# EAGLE design badge_0.1 (EAGLE 7.1.0)
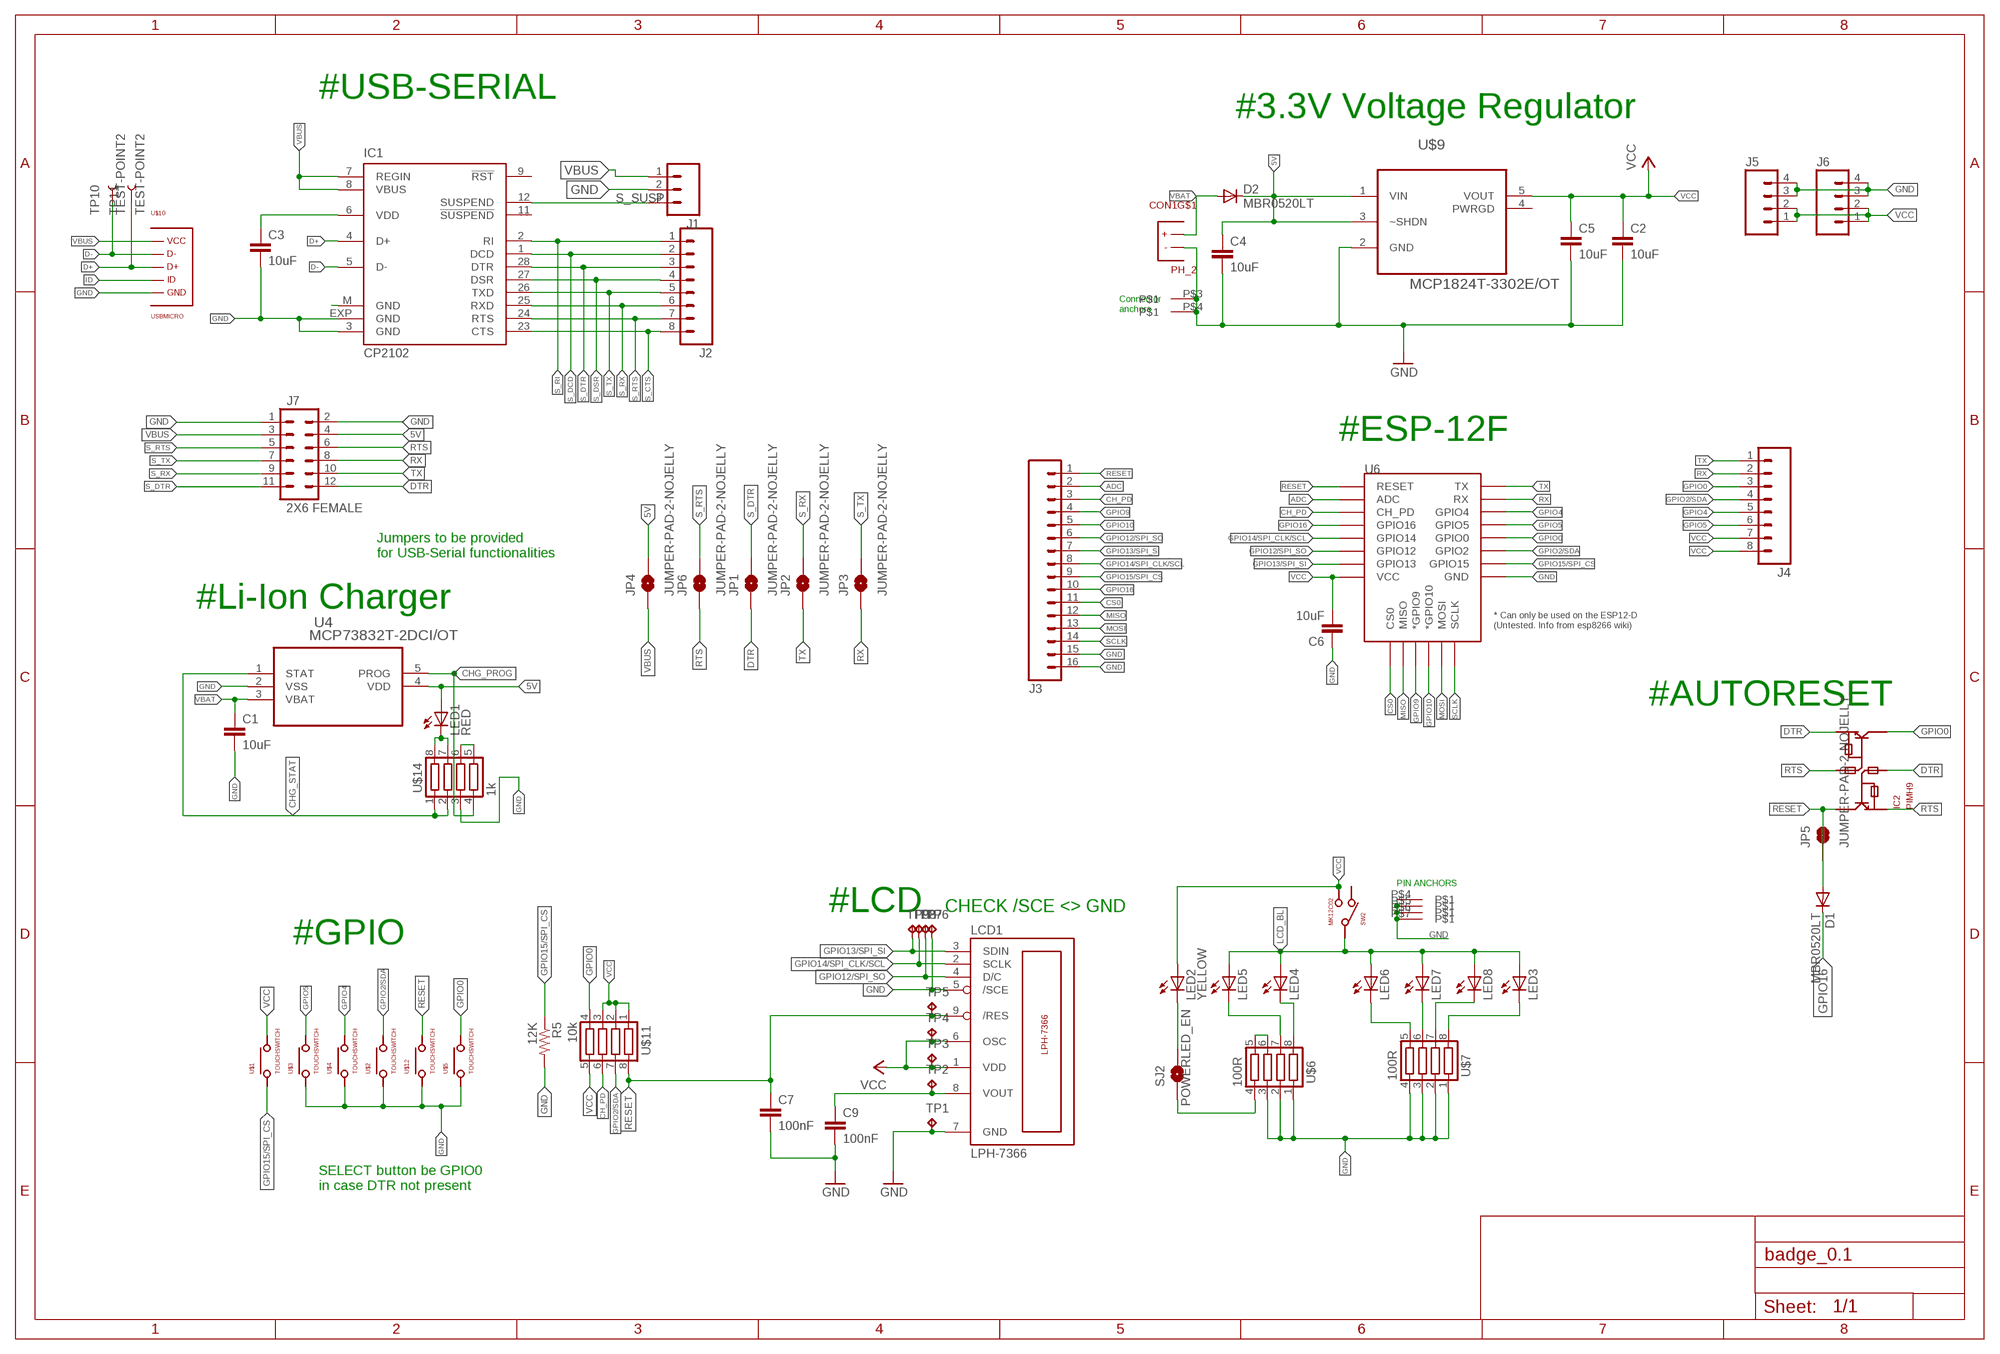
[diagram p0: schematic, sheet 1]

## Parts
C1  10uF  1UF-25V-10%(0805)"  [0805-CAP]
C2  10uF  1UF-25V-10%(0805)"  [0805-CAP]
C3  10uF  1UF-25V-10%(0805)"  [0805-CAP]
C4  10uF  1UF-25V-10%(0805)"  [0805-CAP]
C5  10uF  1UF-25V-10%(0805)"  [0805-CAP]
C6  10uF  1UF-25V-10%(0805)"  [0805-CAP]
C7  100nF  1UF-25V-10%(0805)"  [0805-CAP]
C9  100nF  1UF-25V-10%(0805)"  [0805-CAP]
CON1  PH_2  [PH_2]
D1  MBR0520LT  [SOD123]
D2  MBR0520LT  [SOD123]
IC1  CP2102  [MLP28]
IC2  PIMH9  [SOT457]
J1  M03PTH  [1X03]
J2  M08SILK_FEMALE_PTH  [1X08]
J3  M16PTH  [1X16]
J4  M08  [1X08_ROUND]
J5  M04PTH  [1X04]
J6  M04PTH  [1X04]
J7  2X6 FEMALE  M06X2PTH_FEMALE  [2X6]
JP1  JUMPER-PAD-2-NOJELLY  [JELLYPAD-JUMPER-2-NO_NO_SILK]
JP2  JUMPER-PAD-2-NOJELLY  [JELLYPAD-JUMPER-2-NO_NO_SILK]
JP3  JUMPER-PAD-2-NOJELLY  [JELLYPAD-JUMPER-2-NO_NO_SILK]
JP4  JUMPER-PAD-2-NOJELLY  [JELLYPAD-JUMPER-2-NO_NO_SILK]
JP5  JUMPER-PAD-2-NOJELLY  [JELLYPAD-JUMPER-2-NO_NO_SILK]
JP6  JUMPER-PAD-2-NOJELLY  [JELLYPAD-JUMPER-2-NO_NO_SILK]
LCD1  LPH-7366  [LPH-7366]
LED1  RED  LEDSML0805  [SML0805]
LED2  YELLOW  LEDSML0805  [SML0805]
LED3  LEDSML0805  [SML0805]
LED4  LEDSML0805  [SML0805]
LED5  LEDSML0805  [SML0805]
LED6  LEDSML0805  [SML0805]
LED7  LEDSML0805  [SML0805]
LED8  LEDSML0805  [SML0805]
R5  12K  RESISTOR0805-RES  [0805]
SJ2  POWERLED_EN  SOLDERJUMPERTRACE  [SJ_2S-TRACE]
SW2  MK12C02  [MK12C02]
TP1  TPB1,27  [B1,27]
TP2  TPB1,27  [B1,27]
TP3  TPB1,27  [B1,27]
TP4  TPB1,27  [B1,27]
TP5  TPB1,27  [B1,27]
TP6  TPB1,27  [B1,27]
TP7  TPB1,27  [B1,27]
TP8  TPB1,27  [B1,27]
TP9  TPB1,27  [B1,27]
TP10  TEST-POINT2  [PAD.02X.02]
TP11  TEST-POINT2  [PAD.02X.02]
U4  MCP73832T-2DCI/OT  [SOT95P300X145-5N]
U6  ESP12ESMD  [ESP12E-SMD]
U$1  TOUCHSWITCH  [EVQQWN03W]
U$2  TOUCHSWITCH  [EVQQWN03W]
U$3  TOUCHSWITCH  [EVQQWN03W]
U$4  TOUCHSWITCH  [EVQQWN03W]
U$5  TOUCHSWITCH  [EVQQWN03W]
U$6  100R  RES_ARR  [YC164]
U$7  100R  RES_ARR  [YC164]
U$9  MCP1824T-3302E/OT  [SOT95P270X145-5N]
U$10  USBMICRO  [USBMICRO]
U$11  10k  RES_ARR  [YC164]
U$12  TOUCHSWITCH  [EVQQWN03W]
U$14  1k  RES_ARR  [YC164]

## Nets
5V: C4.1 D2.C J7.4 JP4.2 LED1.A U4.4(VDD) U$9.1(VIN) U$9.3(~SHDN)
ADC: J3.2 U6.ADC
CH_PD: J3.3 U6.CH_PD U$11.6
CHG_PROG: U4.5(PROG) U$14.4
CHG_STAT: U4.1(STAT) U$14.1 U$14.2
CS0: J3.11 U6.CS0
D+: IC1.4(D+) TP11.P$1 U$10.P$D+
D-: IC1.5(D-) TP10.P$1 U$10.P$D-
DTR: IC2.P$2 IC2.P$4 J7.12 JP1.1
GND: C1.2 C2.2 C3.2 C4.2 C5.2 C6.1 C7.2 C9.2 CON1.P$1 CON1.P$3 CON1.P$4 IC1.3(GND) IC1.EXP(GND) J1.2 J3.15 J3.16 J5.3 J5.4 J6.3 J6.4 J7.1 J7.2 LCD1.5(/SCE) LCD1.7(GND) R5.2 SW2.P$4 SW2.P$5 SW2.P$6 SW2.P$7 TP1.TP TP6.TP U4.2(VSS) U6.GND U$2.P$1 U$2.P$4 U$3.P$1 U$3.P$4 U$4.P$1 U$4.P$4 U$5.P$1 U$5.P$4 U$6.1 U$6.2 U$6.3 U$7.1 U$7.2 U$7.3 U$7.4 U$9.2(GND) U$10.P$GND U$12.P$1 U$12.P$4 U$14.3
GPIO0: IC2.P$3 J4.3 U6.GPIO0 U$5.P$2 U$5.P$3 U$11.4
GPIO2/SDA: J4.4 U6.GPIO2 U$2.P$2 U$2.P$3 U$11.7
GPIO4: J4.5 U6.GPIO4 U$4.P$2 U$4.P$3
GPIO5: J4.6 U6.GPIO5 U$3.P$2 U$3.P$3
GPIO9: J3.4 U6.GPIO9(*GPIO9)
GPIO10: J3.5 U6.GPIO10(*GPIO10)
GPIO12/SPI_SO: J3.6 LCD1.4(D/C) TP7.TP U6.GPIO12
GPIO13/SPI_SI: J3.7 LCD1.3(SDIN) TP9.TP U6.GPIO13
GPIO14/SPI_CLK/SCL: J3.8 LCD1.2(SCLK) TP8.TP U6.GPIO14
GPIO15/SPI_CS: J3.9 R5.1 U6.GPIO15 U$1.P$1 U$1.P$4
GPIO16: D1.C J3.10 U6.GPIO16
ID: U$10.P$ID
LCD_BL: LED3.A LED4.A LED5.A LED6.A LED7.A LED8.A SW2.P$2
MISO: J3.12 U6.MISO
MOSI: J3.13 U6.MOSI
N$1: LED1.C U$14.7 U$14.8
N$2: U$14.5 U$14.6
N$5: IC1.M(GND)
N$7: LED7.C U$7.6
N$8: LED8.C U$7.7
N$9: C9.1 LCD1.8(VOUT) TP2.TP
N$11: U$6.5 U$6.6
N$12: LED4.C U$6.8
N$13: LED5.C U$6.7
N$14: LED3.C U$7.8
N$15: SJ2.1 U$6.4
N$16: LED2.C SJ2.2
N$20: C3.1 IC1.6(VDD)
N$22: LED6.C U$7.5
RESET: C7.1 D1.A IC2.P$6 J3.1 JP5.1 JP5.2 LCD1.9(/RES) TP5.TP U6.RESET U$11.8 U$12.P$2 U$12.P$3
RTS: IC2.P$1 IC2.P$5 J7.6 JP6.1
RX: J4.2 J7.8 JP3.1 U6.RXD0(RX)
S_CTS: IC1.23(CTS) J2.8
S_DCD: IC1.1(DCD) J2.2
S_DSR: IC1.27(DSR) J2.4
S_DTR: IC1.28(DTR) J2.3 J7.11 JP1.2
S_RI: IC1.2(RI) J2.1
S_RTS: IC1.24(RTS) J2.7 J7.5 JP6.2
S_RX: IC1.25(RXD) J2.6 J7.9 JP2.2
S_SUSP: IC1.12(SUSPEND) J1.3
S_TX: IC1.26(TXD) J2.5 J7.7 JP3.2
SCLK: J3.14 U6.SCLK
TX: J4.1 J7.10 JP2.1 U6.TXD0(TX)
VBAT: C1.1 CON1.P$2 D2.A U4.3(VBAT)
VBUS: IC1.7(REGIN) IC1.8(VBUS) J1.1 J7.3 JP4.1 U$10.P$VCC
VCC: C2.1 C5.1 C6.2 J4.7 J4.8 J5.1 J5.2 J6.1 J6.2 LCD1.1(VDD) LCD1.6(OSC) LED2.A SW2.P$3 TP3.TP TP4.TP U6.VCC U$1.P$2 U$1.P$3 U$9.5(VOUT) U$11.1 U$11.2 U$11.3 U$11.5
Unconnected: IC1.9(!RST) IC1.11(!SUSPEND) SW2.P$1 U$9.4(PWRGD)

## Notes on the sheet
- #USB-SERIAL
- #3.3V Voltage Regulator
- Connector
  anchors
- #ESP-12F
- Jumpers to be provided
  for USB-Serial functionalities
- #Li-Ion Charger
- #AUTORESET
- PIN ANCHORS
- #LCD | CHECK /SCE <> GND
- #GPIO
- SELECT button be GPIO0
  in case DTR not present

## Library data of the parts
C1-C7 C9 = SparkFun-Capacitors:1UF-25V-10%(0805): CAP-08064
CON1 = badge:PH_2
D1 D2 = diode:MBR0520LT: SCHOTTKY BARRIER RECTIFIER Source: http://onsemi.com .. MBR0520LT1-D.pdf
IC1 = silabs:CP210*: Single-Chip USB to UART Bridge Source: www.silabs.com .. CP2101.pdf / cp2102.pdf; MF: FARNELL; MPN: CP2102-GM; OC_FARNELL: 9282130; OC_NEWARK: 30K5635
IC2 = badge:PIMH9
J1 = SparkFun-Connectors:M03: Header 3 Standard 3-pin 0.1" header. Use with straight break away headers (SKU : PRT-00116), right angle break away headers (PRT-00553), swiss pins (PRT-00743), machine pins (PRT-00117), and female headers (PRT-00115). Molex polarized connector foot print use with SKU : PRT-08232 with associated crimp pins and housings.
J2 = SparkFun-Connectors:M08: Header 8 Standard 8-pin 0.1" header. Use with straight break away headers (SKU : PRT-00116), right angle break away headers (PRT-00553), swiss pins (PRT-00743), machine pins (PRT-00117), and female headers (PRT-00115).; PROD_ID: CONN-08438
J3 = SparkFun-Connectors:M16: 1x16 .1" header
J4 = SparkFun-Connectors:M08: Header 8 Standard 8-pin 0.1" header. Use with straight break away headers (SKU : PRT-00116), right angle break away headers (PRT-00553), swiss pins (PRT-00743), machine pins (PRT-00117), and female headers (PRT-00115).; PROD_ID: CONN-08437
J5 J6 = SparkFun-Connectors:M04: Header 4 Standard 4-pin 0.1" header. Use with straight break away headers (SKU : PRT-00116), right angle break away headers (PRT-00553), swiss pins (PRT-00743), machine pins (PRT-00117), and female headers (PRT-00115). Molex polarized connector foot print use with SKU : PRT-08231 with associated crimp pins and housings. 1MM SMD Version SKU: PRT-10208; PROD_ID: CONN-09696
J7 = SparkFun-Connectors:M06X2; PROD_ID: CONN-12423
JP1-JP6 = SparkFun-Passives:JUMPER-PAD-2-NO
LCD1 = gm2:LPH-7366
LED1-LED8 = led:LED: LED OSRAM: - CHIPLED LG R971, LG N971, LY N971, LG Q971, LY Q971, LO R971, LY R971 LH N974, LH R974 LS Q976, LO Q976, LY Q976 LO Q996 - Hyper CHIPLED LW Q18S LB Q993, LB Q99A, LB R99A - SideLED LS A670, LO A670, LY A670, LG A670, LP A670 LB A673, LV A673, LT A673, LW A673 LH A674 LY A675 LS A676, LA A676, LO A676, LY A676, LW A676 LS A679, LY A679, LG A679 - Hyper Micro SIDELED® LS Y876, LA Y876, LO Y876, LY Y876 LT Y87S - SmartLED LW L88C, LW L88S LB L89C, LB L89S, LG L890 LS L89K, LO L89K, LY L89K LS L896, LA L896, LO L896, LY L896 - TOPLED LS T670, LO T670, LY T670, LG T670, LP T670 LSG T670, LSP T670, LSY T670, LOP T670, LYG T670 LG T671, LOG T671, LSG T671 LB T673, LV T673, LT T673, LW T673 LH T674 LS T676, LA T676, LO T676, LY T676, LB T676, LH T676, LSB T676, LW T676 LB T67C, LV T67C, LT T67C, LS T67K, LO T67K, LY T67K, LW E67C LS E67B, LA E67B, LO E67B, LY E67B, LB E67C, LV E67C, LT E67C LW T67C LS T679, LY T679, LG T679 LS T770, LO T770, LY T770, LG T770, LP T770 LB T773, LV T773, LT T773, LW T773 LH T774 LS E675, LA E675, LY E675, LS T675 LS T776, LA T776, LO T776, LY T776, LB T776 LHGB T686 LT T68C, LB T68C - Hyper Mini TOPLED® LB M676 - Mini TOPLED Santana® LG M470 LS M47K, LO M47K, LY M47K Source: http://www.osram.convergy.de LUXEON: - LUMILED® LXK2-PW12-R00, LXK2-PW12-S00, LXK2-PW14-U00, LXK2-PW14-V00 LXK2-PM12-R00, LXK2-PM12-S00, LXK2-PM14-U00 LXK2-PE12-Q00, LXK2-PE12-R00, LXK2-PE12-S00, LXK2-PE14-T00, LXK2-PE14-U00 LXK2-PB12-K00, LXK2-PB12-L00, LXK2-PB12-M00, LXK2-PB14-N00, LXK2-PB14-P00, LXK2-PB14-Q00 LXK2-PR12-L00, LXK2-PR12-M00, LXK2-PR14-Q00, LXK2-PR14-R00 LXK2-PD12-Q00, LXK2-PD12-R00, LXK2-PD12-S00 LXK2-PH12-R00, LXK2-PH12-S00 LXK2-PL12-P00, LXK2-PL12-Q00, LXK2-PL12-R00 Source: www.luxeon.com KINGBRIGHT: KA-3528ASYC Source: www.kingbright.com
R5 = SparkFun-Passives:RESISTOR: Resistor Basic schematic elements and footprints for 0603, 1206, and PTH resistors.
SJ2 = SparkFun-Retired:SOLDERJUMPER: Solder Jumper Standard SMD solder jumper. Used to automate production. Two varients : Normally Open and Normally Closed are the same, but have different paste layers. NC will have a large amount of paste and should jumper during reflow.
SW2 = badge:MK12C02
TP1-TP9 = testpad:TP: Test pad
TP10 TP11 = SparkFun-Passives:TEST-POINT: Bare copper test points for troubleshooting or ICT
U4 = Microchip_By_element14_Batch_1:MCP73832T-2DCI/OT: IC, BATT CHARGER, Li-Ion Li-Polymer, 500 mA; MPN: MCP73832T-2DCI/OT; OC_FARNELL: 1834892; OC_NEWARK: 84R5198; PACKAGE: SOT23-5; SUPPLIER: Microchip
U6 = esp8266modules:ESP12E: ESP12E Module
U$1-U$5 U$12 = badge:TOUCHSWITCH
U$6 U$7 U$11 U$14 = Simplex-rlc:RES_ARR: resistor chip array yageo YC164 series (8pin/4R)
U$9 = Microchip_By_element14_Batch_1:MCP1824T-3302E/OT: 300 mA, Low Voltage, Low Quiescent Current LDO Regulator; MPN: MCP1824T-3302E/OT; OC_FARNELL: 1578387; OC_NEWARK: 40M0704; PACKAGE: SOT23-5; SUPPLIER: Microchip
U$10 = badge:USBMICRO

## Board
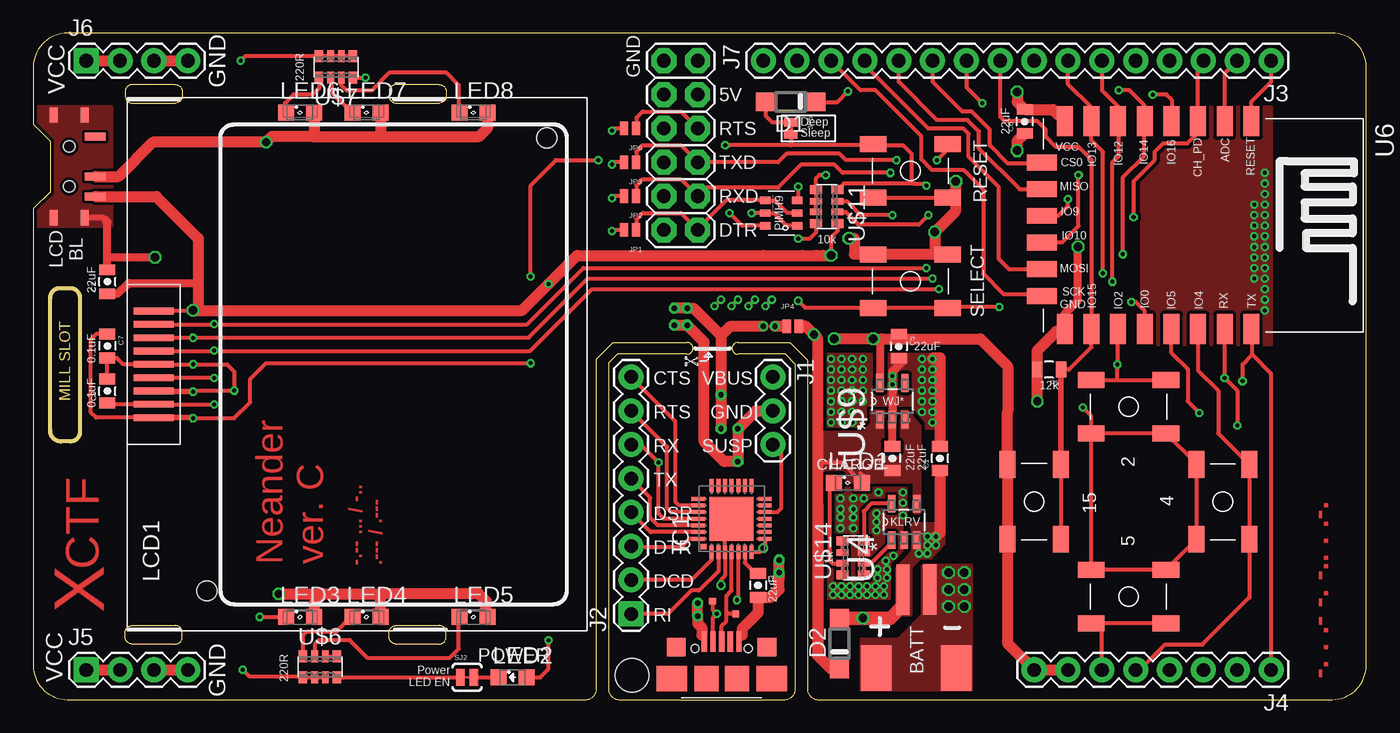
[diagram p1: board, top side]
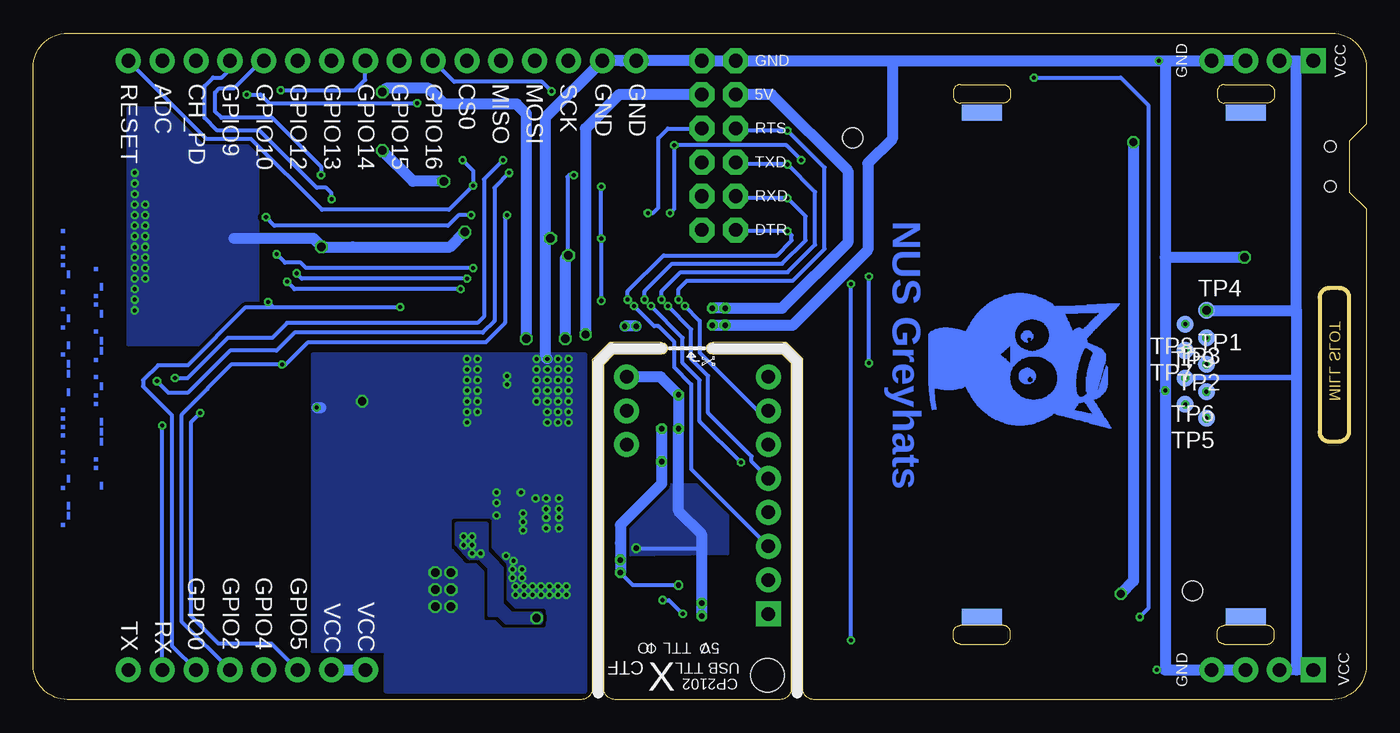
[diagram p2: board, bottom side, seen from below]

Size 100 x 50 mm. Coordinates in mm from the lower left corner, seen from the top.
Outline: 58.88,0 97.46,0 arc90 100,2.54 100,47.46 arc90 97.46,50 2.54,50 arc90 0,47.46 0,43.18 1.27,41.91 1.27,38.1 0,36.83 0,2.54 arc90 2.54,0 41.45,0 arc90 42.27,0.81 42.27,25.56 43.5,26.79 49.05,26.79 arc-180 49.05,25.92 43.81,25.92 43.14,25.24 43.14,0.81 arc90 43.95,0 56.38,0 arc90 57.19,0.81 57.19,25.16 56.44,25.92 52.86,25.92 arc-180 52.86,26.79 56.75,26.79 58.06,25.48 58.06,0.81 arc90 58.88,0
Outline: 1.27,30.16 arc-90 1.98,30.88 2.78,30.88 arc-90 3.49,30.16 3.49,20.08 arc-90 2.78,19.37 2.06,19.37 arc-90 1.27,20.16 1.27,30.16
Copper layers (1*16): Top 0.035mm / dielectric 1.5mm / Bottom 0.035mm
Design rules "dirt_cheap_dirty_boards.v1 *": minimum track width 5mil, minimum drill 12mil, track to track 5mil, track to pad 5mil, pad to pad 5mil, via to via 5mil, smd to smd 0mil, copper to edge 10mil, drill to drill 10mil, minimum pad ring 10mil, minimum via ring 6mil, stop-mask expansion 2mil, vias tented up to drill 25mil, thermal gap 10mil
Holes 2.54 mm at 44.93,1.83

### Footprints (pad centres in the part's own frame; a part is rotated, then mirrored left to right if it is on the bottom)
0805-CAP = smd 0.8 x 1.2: 1 -0.9,0; 2 0.9,0
PH_2 = smd 1 x 3.8: P$1 -1,0; P$2 1,0 | smd 2.3 x 3.4: P$3 -3,5.9; P$4 3,5.9
SOD123 = smd 1.4 x 1.4: A 1.9,0; C -1.9,0
MLP28 = smd 1 x 0.3: 1 -2.5,1.5; 2 -2.5,1; 3 -2.5,0.5; 4 -2.5,0; 5 -2.5,-0.5; 6 -2.5,-1; 7 -2.5,-1.5; 15 2.5,-1.5; 16 2.5,-1; 17 2.5,-0.5; 18 2.5,0; 19 2.5,0.5; 20 2.5,1; 21 2.5,1.5 | smd 0.3 x 1: 8 -1.5,-2.5; 9 -1,-2.5; 10 -0.5,-2.5; 11 0,-2.5; 12 0.5,-2.5; 13 1,-2.5; 14 1.5,-2.5; 22 1.5,2.5; 23 1,2.5; 24 0.5,2.5; 25 0,2.5; 26 -0.5,2.5; 27 -1,2.5; 28 -1.5,2.5 | smd 3.3 x 3.3: EXP 0,0 | smd 0.435 x 0.435: M -2.103,2.103
SOT457 = smd 0.8 x 0.55: P$1 1.2,-0.95; P$2 1.2,0; P$3 1.2,0.95; P$4 -1.2,0.95; P$5 -1.2,0; P$6 -1.2,-0.95
1X03 = drill 1.016 pad 1.88: 1 0,0; 2 2.54,0; 3 5.08,0
1X08 = drill 1.016 pad 1.88 square: 1 0,0 | drill 1.016 pad 1.88: 2 2.54,0; 3 5.08,0; 4 7.62,0; 5 10.16,0; 6 12.7,0; 7 15.24,0; 8 17.78,0
1X16 = drill 1.016 pad 1.88: 1 0,0; 2 2.54,0; 3 5.08,0; 4 7.62,0; 5 10.16,0; 6 12.7,0; 7 15.24,0; 8 17.78,0; 9 20.32,0; 10 22.86,0; 11 25.4,0; 12 27.94,0; 13 30.48,0; 14 33.02,0; 15 35.56,0; 16 38.1,0
1X08_ROUND = drill 1.016 pad 1.88: 1 0,0; 2 2.54,0; 3 5.08,0; 4 7.62,0; 5 10.16,0; 6 12.7,0; 7 15.24,0; 8 17.78,0
1X04 = drill 1.016 pad 1.88 square: 1 0,0 | drill 1.016 pad 1.88: 2 2.54,0; 3 5.08,0; 4 7.62,0
2X6 = drill 1.016 pad 1.88 octagon: 1 0,0; 2 0,2.54; 3 2.54,0; 4 2.54,2.54; 5 5.08,0; 6 5.08,2.54; 7 7.62,0; 8 7.62,2.54; 9 10.16,0; 10 10.16,2.54; 11 12.7,0; 12 12.7,2.54
JELLYPAD-JUMPER-2-NO_NO_SILK = smd 0.635 x 1.016: 1 -0.45,0; 2 0.45,0
LPH-7366 = smd 0.5 x 3: 1 4,17; 2 3,17; 3 2,17; 4 1,17; 5 0,17; 6 -1,17; 7 -2,17; 8 -3,17; 9 -4,17 | smd 1.2 x 3 bottom: F1 -18.9,17; F2 18.9,17; F3 18.9,-2.8; F4 -18.95,-2.8 | hole 1.5: -17,13; 17,-12.5
SML0805 = smd 1.2 x 1.2: A 1.05,0; C -1.05,0
0805 = smd 0.8 x 1.2: 1 -0.9,0; 2 0.9,0
SJ_2S-TRACE = smd 0.635 x 1.27: 1 -0.508,0; 2 0.508,0
MK12C02 = smd 0.6 x 1.6: P$1 -2.25,1.95; P$2 0.75,1.95; P$3 2.25,1.95 | smd 1.15 x 0.6: P$4 -3.85,1.15; P$5 -3.85,-1.15; P$6 3.85,1.15; P$7 3.85,-1.15 | hole 0.85: -1.5,0; 1.5,0
B1,27 = smd 1.27 x 1.27: TP 0,0
PAD.02X.02 = smd 0.508 x 0.508: P$1 0,0
SOT95P300X145-5N = smd 1.321 x 0.559: 1 -1.372,0.94; 2 -1.372,0; 3 -1.372,-0.94; 4 1.372,-0.94; 5 1.372,0.94
ESP12E-SMD = smd 2.25 x 1.2: ADC -7.9,3.8; CH_PD -7.9,1.8; GND 7.7,-8.2; GPIO0 7.7,-2.2; GPIO2 7.7,-4.2; GPIO4 7.7,1.8; GPIO5 7.7,-0.2; GPIO12 -7.9,-4.2; GPIO13 -7.9,-6.2; GPIO14 -7.9,-2.2; GPIO15 7.7,-6.2; GPIO16 -7.9,-0.2; RESET -7.9,5.8; RXD0 7.7,3.8; TXD0 7.7,5.8; VCC -7.9,-8.2 | smd 1.2 x 2.25: CS0 -4.8,-9.9; GPIO9 -0.8,-9.9; GPIO10 1.2,-9.9; MISO -2.8,-9.9; MOSI 3.2,-9.9; SCLK 5.2,-9.9
EVQQWN03W = smd 1.2 x 2: P$1 -2,2.8; P$2 2,2.8; P$3 2,-2.8; P$4 -2,-2.8
YC164 = smd 0.65 x 0.9: 1 -1.275,-0.8; 4 1.275,-0.8; 5 1.275,0.8; 8 -1.275,0.8 | smd 0.5 x 0.9: 2 -0.4,-0.8; 3 0.4,-0.8; 6 0.4,0.8; 7 -0.4,0.8
SOT95P270X145-5N = smd 1.321 x 0.559: 1 -1.372,0.94; 2 -1.372,0; 3 -1.372,-0.94; 4 1.372,-0.94; 5 1.372,0.94
USBMICRO = smd 1.4 x 1.4: P$6 -3.4,2.35; P$7 3.4,2.35 | smd 1.8 x 1.9: P$8 -1.15,0; P$9 1.15,0 | smd 2.3 x 1.9: P$10 -3.75,0; P$11 3.75,0 | smd 0.4 x 1.55: P$D+ 0,2.775; P$D- -0.65,2.775; P$GND 1.3,2.775; P$ID 0.65,2.775; P$VCC -1.3,2.775 | hole 0.6: -2,2.25; 2,2.25

### Placement (x,y rotation side)
C1  68.02,18.1 90 top
C2  5.56,31.35 90 top
C3  54.37,8.57 270 top
C4  64.45,18.1 90 top
C5  64.93,26.51 270 top
C6  74.38,43.39 90 top
C7  5.56,26.54 270 top
C9  5.56,23.15 90 top
CON1  66.25,8.26 180 top
D1  56.83,44.85 180 top
D2  60.48,4.21 90 top
IC1  52.39,13.57 90 top
IC2  56.12,36.51 0 top
J1  55.48,24.21 270 top
J2  44.85,6.43 90 top
J3  92.87,47.94 180 top
J4  92.87,2.22 180 top
J5  3.97,2.22 0 top
J6  3.97,47.94 0 top
J7  47.31,47.94 270 top
JP1  44.77,35.24 180 top
JP2  44.77,37.78 180 top
JP3  44.77,40.32 180 top
JP4  56.99,28.02 0 top
JP5  56.83,42.86 270 top
JP6  44.77,42.86 180 top
LCD1  26.04,25.16 90 top
LED1  61.12,16.27 0 top
LED2  35.96,1.67 0 top
LED3  20,6.19 0 top
LED4  25,6.19 0 top
LED5  33.02,6.19 0 top
LED6  20,44.05 0 top
LED7  25,44.05 0 top
LED8  33.02,44.05 0 top
R5  76.2,24.77 180 top
SJ2  32.54,1.67 0 top
SW2  2.7,40.01 270 top
TP1  11.99,25.16 0 bottom
TP2  13.57,22.15 0 bottom
TP3  13.57,24.13 0 bottom
TP4  11.99,29.21 0 bottom
TP5  11.99,21.11 180 bottom
TP6  11.99,23.1 180 bottom
TP7  13.57,26.19 180 bottom
TP8  13.57,28.18 180 bottom
TP9  11.99,27.15 180 bottom
TP10  50.96,7.38 0 top
TP11  52.7,6.43 0 top
U4  65.33,13.34 90 top
U6  85.59,35.5 270 top
U$1  75.1,14.85 180 top
U$2  82.17,21.98 90 top
U$3  82.17,7.73 270 top
U$4  89.24,14.84 0 top
U$5  65.8,31.4 270 top
U$6  21.51,2.46 0 top
U$7  22.7,47.47 180 top
U$9  64.45,22.38 90 top
U$10  51.65,1.59 0 top
U$11  59.53,36.99 270 top
U$12  65.8,39.69 90 top
U$14  61.52,10.64 90 top

### Tracks (layer width: path | path; a pad name or v marks a point on that pad's centre or on a via)
5V  (via drill 0.61)
  Top 0.305: U$9.3 65.39,20.97 | 57.94,28.02 JP4.2 | 62.07,16.99 62.23,16.83 62.23,16.51 62.17,16.45 LED1.A 60.66,17.78 59.05,17.78 58.9,17.62 58.9,14.61
  Top 0.406: 65.39,20.97 65.63,20.97
  Top 0.813: 58.9,3.25 58.9,14.61 | 58.9,3.25 59.85,2.3 59.85,2.31 D2.C | 57.63,28.02 57.94,28.02 v58.58,27.38 58.82,27.15 58.82,3.33 58.9,3.25
  Bottom 0.813: J7.4 56.04,45.4 58.58,42.86 v58.58,27.38
  pour Top (isolate 0.254, no thermals): 66.12,19.76 66.12,14.05 66.52,14.05 66.52,19.76
  pour Top (isolate 0.254, no thermals): 62.87,21.59 62.87,20.64 62.23,20 58.58,20 58.58,16.35 66.52,16.35 66.52,20.48 65.56,21.59
ADC
  Top 0.305: 89.39,42.55 89.39,47 J3.2
  Top 0.406: 89.39,42.55 U6.ADC
CH_PD  (via drill 0.3)
  Top 0.305: U6.CH_PD 87.39,42.55 87.31,42.48 86.59,41.75 84.77,41.75 84.14,41.12 84.14,40.48 82.55,38.89 v82.55,36.2 | U6.CH_PD 87.39,47.54 J3.3 | v67.15,36.35 66.43,35.64 61.92,35.64 60.96,36.59 U$11.6 | U6.CH_PD
  Top 0.406: 87.31,42.48 87.39,42.48 U6.CH_PD
  Bottom 0.305: v67.15,36.35 68.1,36.35 68.9,35.56 81.92,35.56 v82.55,36.2
CHG_PROG
  Top 0.305: U4.5 62.89,14.71 62.31,14.13 62.31,11.92 U$14.4
CHG_STAT
  Top 0.305: 64.37,12.22 64.39,12.21 U4.1 64.39,11.76 62.86,10.24 U$14.2 U$14.1
CS0
  Top 0.305: J3.11 67.47,46.35 69.69,44.13 70.41,44.13 71.75,42.78 71.75,41.59 73.09,40.25 75.69,40.25 U6.CS0
D+
  Top 0.305: U$10.P$D+ 51.65,5.53 51.99,5.87 51.99,6.43 | 51.99,6.43 51.99,7.78 52.39,8.18 IC1.4 | TP11.P$1 51.99,6.43
D-  (via drill 0.3)
  Top 0.305: U$10.P$D- 51,6.15 v51.28,6.43 50.96,6.75 TP10.P$1 | v52.78,7.46 52.89,7.56 IC1.5
  Bottom 0.305: v51.28,6.43 52.31,7.46 v52.78,7.46
DTR
  Top 0.305: IC2.P$2 56.59,36.51 55.64,37.46 IC2.P$4 51.99,37.47 49.85,35.32 J7.12 48.58,36.51 45.72,36.51 45.24,36.04 45.24,35.27 JP1.1
GND  (via drill 0.3, 0.41, 0.41 pad 0.81, 0.61, 0.64)
  Top 0.305: U$7.1 U$7.2 U$7.3 U$7.4 15.88,48.27 v15.56,47.94 | U$6.3 U$6.2 U$6.1 20.15,1.75 16.19,1.75 v15.72,2.22 | 69.11,33.5 67.63,33.5 | 61.44,34.77 61.59,34.61 | U$4.P$1 U$4.P$4 | U$2.P$1 U$2.P$4 87.24,17.7 | U$3.P$1 U$3.P$4 U$2.P$1 | J6.3 8.97,47.94 | TP6.TP 9.1,23.1 LCD1.7 9.02,23.18 v15.08,23.18 15.08,24.61 14.53,25.16 TP1.TP LCD1.5 6.75,25.16 6.27,25.64 C7.2 C9.2 | v51.59,8.57 51.59,8.97 51.89,9.26 IC1.3 51.89,12.91 52.05,13.07 52.05,13.23 IC1.EXP | U$10.P$GND 52.95,4.61 53.18,4.84 | U$3.P$1 87.23,11.99 | U$2.P$1 79.37,21.28 v78.74,21.91 | U$12.P$1 U$12.P$4 69.22,37.07 69.22,36.67
  Top 0.406: SW2.P$6 5.24,36.16 5.4,36
  Top 0.546: 15.06,23.16 v15.08,23.18
  Top 0.61: 65.17,25.32 64.45,24.61 v64.45,24.29 v64.45,23.65 U$9.2 C4.2 | U$4.P$1 87.24,17.7 | U$4.P$4 87.24,12 | U6.GND 77.39,28.97 78.38,29.96 v78.38,33.97 | C6.1 74.38,42.47 | U$3.P$1 | C2.2 5.56,33.18 | 5.56,33.18 5.56,35.84 5.4,36 | v9.13,33.18 5.56,33.18
  Top 0.813: C1.2 68.02,25.64 67.55,25.64 v67.47,25.56 | 77.39,27.55 U6.GND | U6.GND 77.39,27.54 | 67.63,33.5 v67.63,35.08 69.22,36.67 v69.22,38.89 69.2,38.88 | J5.3 J5.4 | J6.3 J6.4 | v55.96,9.53 v55.96,10.48 | v48.1,28.1 v49.05,28.1 50.32,26.83 50.32,19.37 51.83,17.86 v52.86,17.86 v52.86,20.32 54.21,21.67 J1.2 | v61.2,34.61 61.59,34.61 61.59,33.4 U$5.P$4 U$5.P$1 | v73.82,41.2 73.82,41.93 C6.1 | 77.37,27.78 U6.GND | v55.96,9.53 55.96,9.05 | 53.18,4.84 53.18,5.32 54.37,6.51 C3.2 55.38,7.67 55.96,8.26 v55.96,9.53 | 77.39,27.45 77.39,27.55 | 77.39,27.55 77.31,27.62 76.76,27.62 75.3,26.17 R5.2 75.3,22.41 v75.33,22.38
  Bottom 0.305: 55.56,47.62 55.88,47.94 | 55.56,47.78 55.4,47.94 | 15.08,2.22 v15.72,2.22 | 55.88,11.83 55.96,11.75 | 55.88,9.45 v55.96,9.53 55.01,8.57 v51.59,8.57
  Bottom 0.406: 76.2,34.13 76.04,33.97
  Bottom 0.813: 61.59,34.45 61.59,43.66 J3.15 55.88,47.94 55.4,47.94 J3.16 J7.2 J7.1 35.24,47.94 | v67.63,35.08 68.74,33.97 76.04,33.97 v78.38,33.97 78.38,34.01 78.98,34.61 84.93,34.61 | J6.3 J6.4 15.08,47.94 | 35.24,47.94 v15.56,47.94 15.08,47.94 | 15.08,47.94 15.08,33.18 | 15.08,33.18 v15.08,23.18 15.08,2.22 J5.4 J5.3 | v52.86,20.32 v52.86,17.86 52.86,16.19 55.96,13.1 55.96,11.75 v55.96,10.48 v55.96,9.53 | v49.05,28.1 v48.1,28.1 43.02,28.1 37.39,33.73 37.39,40.24 35.56,42.07 35.56,47.62 35.24,47.94 | v61.2,34.61 61.44,34.61 61.59,34.45 | v9.13,33.18 15.08,33.18 | 61.59,34.45 61.59,25.72 v61.44,25.56 | v69.22,38.89 71.52,38.89 v73.82,41.2 | v78.74,21.91 78.42,21.91
  other vias: 60.64,25.56 62.23,25.56 60.64,24.77 61.44,24.77 62.23,24.77 62.23,23.97 61.44,23.97 60.64,23.97 60.64,23.18 61.44,23.18 62.23,23.18 62.23,22.38 61.44,22.38 60.64,22.38 60.64,21.59 61.44,21.59 61.44,20.8 60.64,20.8 66.67,25.56 66.67,24.77 66.67,23.97 66.67,23.18 66.67,22.38 66.67,21.59 65.25,14.76 68.66,9.53 65.25,15.56 63.26,13.97 63.26,13.34 63.26,12.7 60.64,7.86 61.91,7.86 62.55,7.86 63.18,7.86 61.28,7.86 59.85,25.56 59.85,24.77 59.85,23.97 59.85,23.18 59.85,22.38 59.85,21.59 59.85,20.8 67.47,20.8 67.47,21.59 67.47,22.38 67.47,23.18 67.47,23.97 67.47,24.77 68.66,6.99 92.39,39.53 92.39,38.73 92.39,37.94 91.6,37.15 92.39,37.15 91.6,36.35 92.39,36.35 91.6,35.56 92.39,35.56 91.6,34.77 92.39,34.77 91.6,33.97 92.39,33.97 91.6,33.18 92.39,33.18 91.6,32.38 92.39,32.38 91.6,31.59 92.39,31.59 92.39,30.8 92.39,30 92.39,29.21 11.99,23.1 11.99,25.16 68.66,8.26 69.85,6.99 69.85,8.26 69.85,9.53 63.18,8.49 62.55,8.49 61.91,8.49 61.28,8.49 60.64,8.49 63.82,7.86 63.82,8.49 60.01,7.86 60.01,8.49 63.34,9.13 64.06,9.13 64.06,9.76 63.34,9.76 63.98,10.4 64.53,10.79 65.25,13.81 60.56,12.86 61.52,12.86 61.52,13.65 60.56,13.65 61.52,14.29 60.56,14.29 61.52,15.08 60.56,15.08 62.31,15.08 63.42,15.56
  pour Top (isolate 0.254, rank 3, no thermals): 59.53,20.4 59.53,25.88 67.79,25.88 67.79,20.4
  pour Bottom (isolate 0.254, rank 3, no thermals): 58.58,25.88 79.06,25.88 79.06,3.65 73.58,3.65 73.58,0.64 58.58,0.64
  pour Top (isolate 0.203, rank 2, no thermals): 59.61,15.8 59.61,7.62 64.21,7.62 64.21,10.24 65.17,11.19 65.17,13.26 65.48,13.57 65.48,15.8
  pour Top (isolate 0.254): 92.87,44.45 92.87,26.65 83.19,26.65 83.19,44.45
  pour Bottom (isolate 0.254): 92.87,44.37 92.87,26.65 83.19,26.65 83.19,44.37
  pour Top (isolate 0.203, rank 2, no thermals): 0.24,44.45 0.24,35.56 5.87,35.56 5.87,44.45
  pour Top (isolate 0.254, rank 3, no thermals): 62.15,0.71 62.15,4.52 64.93,4.52 66.75,6.35 66.75,10.08 70.33,10.08 70.33,0.71
GPIO0  (via drill 0.3)
  Top 0.305: v82.39,29.84 82.71,29.84 83.39,29.17 U6.GPIO0 | v72.47,29.45 68.65,29.45 U$5.P$2 U$5.P$3 57.91,29.4 v57.39,29.92 | IC2.P$3 | IC2.P$3 | 58.49,35.71 U$11.4 58.74,35.08 58.26,34.61 v57.39,34.61 | IC2.P$3 57.39,37.53 v57.39,38.5
  Bottom 0.305: J4.3 89.61,4.05 89.61,21.35 91.76,23.5 91.76,23.97 90.65,25.08 88.42,25.08 84.06,29.45 81.99,29.45 | 82.31,29.84 v82.39,29.84 81.99,29.45 | 81.99,29.45 v72.47,29.45 | v57.39,38.5 v57.39,34.61 v57.39,29.92
GPIO2/SDA  (via drill 0.3 pad 0.3)
  Top 0.305: U$2.P$2 81.34,23.98 | 81.34,23.98 U$2.P$3 | 81.34,23.98 v81.34,25.13 81.34,27.75 U6.GPIO2 | v64.45,36.35 62.07,36.35 61.04,37.39 U$11.7
  Bottom 0.305: v64.45,36.35 64.61,36.2 64.61,28.26 66.04,26.83 79.38,26.83 81.07,25.13 v81.34,25.13 85.16,25.13 86.95,23.34 86.95,23.3 88.9,21.35 88.9,5.87 J4.4
GPIO4
  Top 0.305: U$4.P$2 U$4.P$3 91.24,7.66 87.71,4.13 84.93,4.13 83.03,2.22 J4.5 | 91.2,17.6 U$4.P$2 | U6.GPIO4 87.39,24.69 88.9,23.18 88.9,19.98 U$4.P$2
GPIO5  (via drill 0.3)
  Top 0.305: U$3.P$2 U$3.P$3 | U$3.P$3 | v87.47,21.51 86.6,22.38 86.6,24.8 85.39,26.01 U6.GPIO5 | J4.6 80.17,5.73 U$3.P$3
  Bottom 0.305: v87.47,21.51 88.19,20.8 88.19,6.27 86.12,4.21 82.15,4.21 J4.6
GPIO9  (via drill 0.3)
  Top 0.305: v77.63,37.54 77.63,37.04 76.89,36.3 U6.GPIO9 75.69,36.34
  Bottom 0.305: J3.4 85.25,47.31 85.88,46.67 86.52,46.67 87.15,46.04 87.15,43.66 86.2,42.7 83.03,42.7 78.74,38.42 78.03,38.42 77.63,38.02 v77.63,37.54
GPIO10  (via drill 0.3)
  Top 0.305: v78.42,39.37 78.42,35.54 77.18,34.3 U6.GPIO10
  Bottom 0.305: J3.5 82.87,47.94 84.93,45.88 86.04,45.88 86.36,45.56 86.36,44.13 85.88,43.66 82.07,43.66 78.42,40.01 v78.42,39.37
GPIO12/SPI_SO  (via drill 0.3, 0.3 pad 0.3)
  Top 0.305: v67.94,30.8 41.91,30.8 37.27,26.16 13.57,26.16 | J3.6 80.17,45.72 81.44,44.45 81.44,42.6 | 81.44,42.6 81.39,42.55 | 81.44,42.6 81.44,40.8 80.96,40.32 v80.96,31.35 | LCD1.4 13.57,26.16 | TP7.TP 13.57,26.16
  Top 0.406: 81.39,42.55 U6.GPIO12
  Bottom 0.305: v67.94,30.8 80.41,30.8 v80.96,31.35
  other vias: 13.57,26.19
GPIO13/SPI_SI  (via drill 0.3, 0.3 pad 0.3)
  Top 0.305: v67.47,31.59 41.59,31.59 37.16,27.16 TP9.TP | J3.7 77.63,46.2 79.39,44.44 U6.GPIO13 79.38,43.39 79.38,41.99 80.25,41.12 v80.25,31.99 | 79.38,42.54 79.39,42.55 | LCD1.3 TP9.TP | TP9.TP
  Top 0.406: 79.39,42.55 U6.GPIO13
  Bottom 0.305: v67.47,31.59 79.85,31.59 v80.25,31.99
  other vias: 11.99,27.15
GPIO14/SPI_CLK/SCL  (via drill 0.3, 0.3 pad 0.3)
  Top 0.305: v66.99,32.38 41.27,32.38 37.05,28.16 13.57,28.16 | 83.39,44.29 83.39,42.55 83.34,42.51 83.34,40.8 81.76,39.21 v81.76,33.42 | LCD1.2 13.57,28.16 | TP8.TP 13.57,28.16 | 83.39,44.41 83.39,44.57 82.23,45.72 v81.44,45.72
  Top 0.406: 83.34,42.51 83.39,42.51 U6.GPIO14 | 83.39,44.29 83.39,44.41
  Bottom 0.305: J3.8 75.09,46.51 75.88,45.72 v81.44,45.72 | v66.99,32.38 79.53,32.38 79.93,32.78 81.12,32.78 v81.76,33.42
  other vias: 13.57,28.18
GPIO15/SPI_CS
  Top 0.305: U$1.P$4 U$1.P$1 | 77.08,17.65 76.72,17.65 | J3.9 72.55,43.74 72.87,43.42 75.33,43.42 75.96,42.78 75.96,42.23 76.73,41.46 78.43,41.46 79.39,40.51 U6.GPIO15 79.39,26.44 77.71,24.77 R5.1
  Top 0.406: 77.08,17.65 U$1.P$4 R5.1
GPIO16  (via drill 0.3)
  Top 0.305: 85.39,42.55 85.41,42.57 85.41,45.01 85.01,45.4 v83.98,45.4 | J3.10 70.01,45.96 v71.2,44.77 | D1.C 60.33,44.85 v61.12,45.64
  Top 0.406: 85.39,42.55 U6.GPIO16
  Bottom 0.305: J3.10 68.42,46.35 61.83,46.35 v61.12,45.64 | v83.98,45.4 82.95,45.4 82.31,44.77 v71.2,44.77
LCD_BL  (via drill 0.6)
  Top 0.305: 26.05,7.88 26.11,7.94 | 26.05,42.27 26.04,42.26 | 21.05,42.35 20.95,42.26
  Top 0.813: 21.75,7.94 21.05,7.24 LED3.A | 21.75,7.94 26.11,7.94 33.42,7.94 33.97,7.38 33.97,6.29 LED5.A | LED4.A 26.05,7.88 | LED7.A 26.05,42.27 | LED6.A 21.05,42.35 | SW2.P$2 6.39,39.26 8.97,41.83 v17.46,41.83 17.89,42.26 20.95,42.26 26.04,42.26 33.44,42.26 34.07,42.88 LED8.A | v18.41,7.94 21.75,7.94
  Bottom 0.813: v17.46,41.83 17.46,8.89 v18.41,7.94
MISO
  Top 0.305: 75.69,38.25 U6.MISO 74,38.3 70.96,41.34 70.96,42.62 70.09,43.5 67.79,43.5 64.93,46.35 J3.12
MOSI
  Top 0.305: J3.13 62.39,47.62 67.15,42.86 69.77,42.86 70.17,42.47 70.17,40.74 72.41,38.49 72.41,33.09 73.2,32.3 U6.MOSI
N$1
  Top 0.305: U$14.7 59.94,10.23 59.77,10.4 59.77,15.97 LED1.C | U$14.7 | U$14.7 U$14.8
N$2
  Top 0.305: U$14.6 U$14.5
N$7
  Top 0.305: U$7.6 22.3,46.6 22.38,46.51 22.38,45.56 23.5,44.45 23.56,44.45 LED7.C
N$8
  Top 0.305: U$7.7 23.1,46.11 23.5,45.72 25.4,45.72 26.75,47.07 30.96,47.07 31.91,46.12 31.91,44.11 LED8.C
N$9  (via drill 0.3)
  Top 0.305: TP2.TP LCD1.8 5.65,22.16 C9.1
  other vias: 13.57,22.15
N$11
  Top 0.305: U$6.6 U$6.5
N$12
  Top 0.305: LED4.C 23.81,6.19 22.7,5.08 20.48,5.08 20.24,4.84 U$6.8
N$13
  Top 0.305: U$6.7 21.11,4.13 21.43,4.45 23.73,4.45 25.08,3.1 31.19,3.1 31.91,3.81 31.91,6.13 LED5.C
N$14  (via drill 0.3)
  Top 0.305: U$7.8 v24.92,46.67 | v16.99,6.19 LED3.C
  Bottom 0.305: v24.92,46.67 18.41,46.67 16.35,44.61 16.35,6.83 v16.99,6.19
N$15
  Top 0.305: U$6.4 SJ2.1
  Top 0.61: SJ2.1
N$16
  Top 0.305: 34.59,1.35 LED2.C SJ2.2
N$20
  Top 0.305: IC1.6 53.39,10.27 54.19,9.47 C3.1
N$22
  Top 0.305: 18.73,44.28 LED6.C 18.89,44.11 18.89,44.77 19.53,45.4 20.95,45.4 21.43,45.88 21.43,46.51 21.43,46.52 U$7.5
RESET  (via drill 0.3, 0.3 pad 0.3)
  Top 0.305: 91.39,42.55 91.39,44.87 92.87,46.35 J3.1 | 66.04,38.73 66.83,38.73 v66.99,38.58 | U$12.P$3 68.99,41.69 v67.79,40.48 | 66.04,38.73 65.88,38.89 65.88,40.96 65.25,41.59 63.02,41.59 | 66.04,38.73 60.8,38.73 U$11.8 | IC2.P$6 53.18,35.56 v52.23,36.51 | TP5.TP 15.08,21.11 16.27,22.3 16.27,24.05 17.46,25.24 v37.31,25.24 | v37.31,31.75 37.31,38.58 39.21,40.48 v42.39,40.48 | U$12.P$2 63,41.61 63.02,41.59 | 63.02,41.59 56.83,41.59 | 56.83,41.59 v51.91,41.59 | 56.83,41.59 JP5.2 JP5.1 56.81,43.34 55.4,43.34 54.93,43.81 D1.A | C7.1 4.73,27.43 4.29,26.99 4.29,21.59 4.72,21.16 LCD1.9
  Top 0.406: LCD1.9 11.94,21.16 TP5.TP | 91.39,42.55 U6.RESET
  Bottom 0.305: J3.1 87,42.07 83.66,42.07 78.34,36.75 68.82,36.75 v66.99,38.58 66.99,39.69 v67.79,40.48 | v37.31,25.24 v37.31,31.75 | v42.39,40.48 43.5,41.59 v51.91,41.59 51.91,36.83 v52.23,36.51
  other vias: 11.99,21.11
RTS  (via drill 0.3)
  Top 0.305: IC2.P$1 56.51,35.56 55.56,36.51 IC2.P$5 v53.9,36.51 | J7.6 48.58,44.13 45.72,44.13 45.24,43.66 45.24,42.89 JP6.1
  Bottom 0.305: v53.9,36.51 53.5,36.51 53.1,36.91 53.1,42.15 52.39,42.86 J7.6
RX  (via drill 0.3, 0.3 pad 0.3)
  Top 0.305: v64.77,40.48 60.96,40.48 60.48,40.96 56.52,40.96 55.88,40.32 J7.8 48.58,41.59 45.72,41.59 45.24,41.12 45.24,40.35 JP3.1 | U6.RXD0 89.38,27.79 v89.38,24.13 90.33,23.18 v90.33,20.56
  Bottom 0.305: v64.77,40.48 66.2,39.05 66.2,28.73 66.67,28.26 80.96,28.26 82.07,27.15 85.41,27.15 88.42,24.13 v89.38,24.13 | J4.2 v90.33,20.56
S_CTS
  Top 0.305: J2.8 48.18,20.88 48.18,14.84 48.45,14.57 IC1.23
S_DCD
  Top 0.305: IC1.1 50.89,10.49 49.37,8.97 J2.2
S_DSR
  Top 0.305: IC1.27 46.32,12.57 J2.4
S_DTR  (via drill 0.3)
  Top 0.305: v54.93,29.53 v55.4,30 | 47.25,35.19 J7.11 | IC1.28 49.22,12.07 48.58,11.43 44.93,11.43 J2.3 | JP1.2 43.5,35.24 v43.42,35.16
  Bottom 0.305: J2.3 50.64,17.3 50.64,23.65 51.91,24.92 51.91,26.83 53.1,28.02 53.42,28.02 v54.93,29.53 | v55.4,30 55.4,30.64 52.7,33.34 44.21,33.34 43.1,34.45 43.1,34.85 v43.42,35.16 47.23,35.16 J7.11
S_RI
  Top 0.305: J2.1 47.62,6.43 49.37,8.18 49.93,8.18 51.39,9.64 IC1.2
S_RTS  (via drill 0.3)
  Top 0.305: v51.12,29.53 v51.59,30 | J2.7 47.55,18.97 47.55,14.37 47.84,14.07 IC1.24 | 47.17,42.73 J7.5 | JP6.2 43.58,42.86 v43.42,42.7
  Bottom 0.305: v51.59,30 51.59,30.8 50.96,31.43 43.02,31.43 40.64,33.81 40.64,39.93 v43.42,42.7 47.15,42.7 J7.5 | J2.7 45.64,21.67 50.01,26.04 50.01,28.42 v51.12,29.53
S_RX  (via drill 0.3)
  Top 0.305: v53.66,29.53 v54.13,30 | J2.6 45.56,19.13 v46.91,17.78 46.91,13.97 47.31,13.57 IC1.25 | 47.17,37.65 J7.9 | JP2.2 43.58,37.78 v43.42,37.62
  Bottom 0.305: v46.91,17.78 50.01,20.88 50.01,23.97 51.28,25.24 51.28,27.15 v53.66,29.53 | v54.13,30 54.13,30.64 52.07,32.7 43.81,32.7 42.07,34.45 42.07,36.27 v43.42,37.62 47.15,37.62 J7.9
S_SUSP
  Top 0.305: IC1.12 55.82,14.07 56.12,14.37 56.12,18.49 J1.3
S_TX  (via drill 0.3)
  Top 0.305: v52.39,29.53 v52.86,30 | IC1.26 46.85,13.07 46.28,13.65 46.28,15.16 J2.5 | JP3.2 43.58,40.32 v43.42,40.16
  Bottom 0.305: J2.5 46.12,17.86 46.12,18.26 49.37,21.51 49.37,24.29 50.64,25.56 50.64,27.78 v52.39,29.53 | v52.86,30 52.86,30.64 51.44,32.07 43.42,32.07 41.35,34.13 41.35,38.1 v43.42,40.16 47.15,40.16 J7.7
SCLK
  Top 0.305: J3.14 62.07,45.72 63.18,45.72 66.62,42.29 66.62,40.54 67.39,39.77 69.77,39.77 71.28,38.26 71.28,31.96 72.83,30.4 75.59,30.4 U6.SCLK
TX  (via drill 0.3 pad 0.3)
  Top 0.305: v64.29,39.53 60.72,39.53 60.09,40.16 57.63,40.16 55.88,38.42 50.48,38.42 J7.10 48.58,39.05 45.72,39.05 45.24,38.58 45.24,37.81 JP2.1 | J4.1 92.87,24.45 91.44,25.88 | 91.44,25.88 91.44,27.75 U6.TXD0 | v90.73,23.89 90.73,25.16 91.44,25.88
  Bottom 0.305: v64.29,39.53 65.41,38.42 65.41,28.42 66.28,27.54 80.41,27.54 81.76,26.19 85.25,26.19 88.42,23.02 89.85,23.02 v90.73,23.89
VBAT  (via drill 0.3, 0.61)
  Top 0.813: C1.1 68.02,12.54 v67.71,12.22
  Top 1.016: D2.A 64.29,6.11 65.25,7.06 CON1.P$2
  other vias: 67.07,12.22 67.07,11.59 67.07,10.95 66.44,10.95 67.71,11.59 62.23,6.11
  pour Top (isolate 0.254, no thermals): 64.85,6.35 64.85,9.84 65.88,10.95 65.96,13.18 68.26,13.18 68.26,11.67 67.31,10.64 66.52,10.64 65.8,9.92 65.8,6.35
  pour Bottom (rank 2, no thermals): 65.96,13.18 68.26,13.18 68.26,11.67 67.31,10.64 66.52,10.64 65.8,9.92 65.8,6.35 65.09,6.35 64.53,5.79 61.91,5.79 61.91,6.43 64.14,6.43 64.85,7.14 64.85,9.84 65.96,11.03
VBUS  (via drill 0.41, 0.41 pad 0.81)
  Top 0.305: U$10.P$VCC 50.35,4.66 50.16,4.84 | JP4.1 56.28,28.02 | IC1.7 54.49,11.07 v54.77,11.35 54.89,11.47 IC1.8
  Top 0.813: v49.85,7.22 v49.85,6.27 49.85,5.71 50.16,5.4 50.16,4.84 | v48.1,29.37 v49.05,29.37 49.53,29.37 51.59,27.3 | 51.59,27.3 v51.59,20.32 | 51.59,27.3 52.31,28.02 v54.77,28.02 | v55.64,28.02 56.28,28.02
  Bottom 0.305: v54.77,11.35 49.93,11.35 49.85,11.27
  Bottom 0.813: v49.05,29.37 v48.1,29.37 43.81,29.37 38.89,34.29 38.89,39.69 44.61,45.4 J7.3 | J1.1 52.94,24.21 v51.59,22.86 v51.59,20.32 51.59,14.13 49.85,12.38 49.85,11.27 v49.85,6.27 | v54.77,28.02 v55.64,28.02
  pour Bottom (isolate 0.254, no thermals): 47.94,16.19 47.94,10.95 56.04,10.87 56.04,13.02 52.94,16.11
VCC  (via drill 0.3, 0.64)
  Top 0.305: LCD1.1 9.04,29.2 9.05,29.21 TP4.TP | 54.77,33.34 | 58.74,33.34 | LCD1.6 13.54,24.16 TP3.TP | 77.39,43.26 U6.VCC | LED2.A 38.02,1.67 38.66,2.3 v38.66,4.45 | 59.14,33.41 59.21,33.34 | 57.55,33.5 57.71,33.34 | 59.78,33.41 v59.85,33.34 59.85,34.69 60.33,35.17 U$11.5 | U$11.2 | U$11.3 U$11.2 | U$11.1 58.73,38.65 | U$11.1 U$11.2 | v59.45,39.37 58.98,39.37 58.73,39.13 U$11.1
  Top 0.406: 77.39,43.26 U6.VCC
  Top 0.61: 63.5,26.91 U$9.5 | 12.38,31.27 7.14,31.27 6.32,30.45 C2.1
  Top 0.813: TP4.TP 12.38,29.21 | SW2.P$3 9.23,37.76 12.38,34.61 12.38,31.27 12.38,29.21 | 63.66,27.07 v63.02,27.07 v60.09,27.07 | 63.66,27.07 64.93,27.07 | 64.93,27.07 71.04,27.07 73.1,25 73.1,21.61 73.1,21.6 U$1.P$3 U$1.P$2 73.1,4.21 J4.8 | v59.85,33.34 59.21,33.34 58.74,33.34 57.71,33.34 54.77,33.34 40.8,33.34 v38.66,31.19 36.67,29.21 12.38,29.21 | J5.1 J5.2 | J6.1 J6.2 | U6.VCC 76.5,44.29 C6.2 73.82,44.84 v73.82,45.61 | 75.25,2.22 J4.7 | 63.5,26.91 63.66,27.07 | C5.1 64.93,27.07
  Bottom 0.305: 5.4,17.22 5.24,17.07 | 5.32,16.67 5.24,16.75 | 5.32,24.69 5.24,24.61 | v38.66,4.45 v38.66,31.19 | 59.77,33.42 v59.85,33.34 59.93,33.42 59.93,39.21 59.77,39.37 v59.45,39.37
  Bottom 0.406: TP3.TP 13.57,24.16 5.24,24.16 5.24,24.13
  Bottom 0.813: v63.02,27.07 63.02,43.97 63.74,44.69 69.14,44.69 70.33,45.88 73.55,45.88 v73.82,45.61 73.77,45.56 | J6.2 5.24,47.94 | 5.24,47.94 J6.1 | J5.1 5.24,2.22 | 5.24,2.22 J5.2 | TP4.TP 5.24,29.21 | 5.24,29.21 5.24,47.94 | 5.24,29.21 5.24,24.61 5.24,24.13 5.24,17.07 5.24,16.75 5.24,2.22 | J4.7 J4.8 | v60.09,27.07 60.09,33.1 v59.85,33.34
  other vias: 11.99,29.21 13.57,24.13
(copper drawn outside any net)
  shapes: Bottom area x832

### Text on the board
Top: CTF | Neander / ver. C | -.-- ... / -.. / .--- / .--- | X | -. . .- -. -.. . .-.
Bottom: NUS Greyhats | . -..- .--. .-.. --- .. - / . ...- . .-. -.-- - .... .. -. --.
Dimension: MILL SLOT
tPlace: GND | VCC | 220R | GND | 5V | RTS | Deep / Sleep | 22uF | VCC | IO13 | IO12 | IO14 | IO16 | CH_PD | ADC | RESET | TXD | CS0 | MISO | RXD | PIM!H9 | RESET | IO9 | DTR | 10k | IO10 | LCD / BL | 22uF | MOSI | SCK | GND | IO15 | IO2 | IO0 | IO5 | IO4 | RX | TX | SELECT | 22uF | 0.1uF | CTS | VBUS | 12k | 0.1uF | RTS | GND | WJ* | RX | SUSP | CHARGE | 22uF | 22uF | 2 | TX | 4 | DSR | 15 | KLRV | 5 | DTR | 1k | DCD | 22uF | RI | BATT | VCC | POWER | GND | 220R | Power / LED EN
bPlace: VCC | GND | GND | GND | GND | SCK | MOSI | MISO | CS0 | GPIO16 | GPIO15 | GPIO14 | GPIO13 | GPIO12 | GPIO10 | GPIO9 | CH_PD | ADC | RESET | 5V | RTS | TXD | RXD | DTR | GPIO5 | GPIO4 | GPIO2 | GPIO0 | VCC | VCC | RX | TX | 5V TTL IO | VCC | GND | USB TTL | X | CTF | CP2102
tStop: CTF | Neander / ver. C | -.-- ... / -.. / .--- / .--- | X | -. . .- -. -.. . .-.
bStop: NUS Greyhats | . -..- .--. .-.. --- .. - / . ...- . .-. -.-- - .... .. -. --.